# Altium schematic sheet ECG_Main.SchDoc: Heart ECG Monitor
size Letter; DrawnBy: Avishka Herath; SheetNumber: 1; SheetTotal: 3
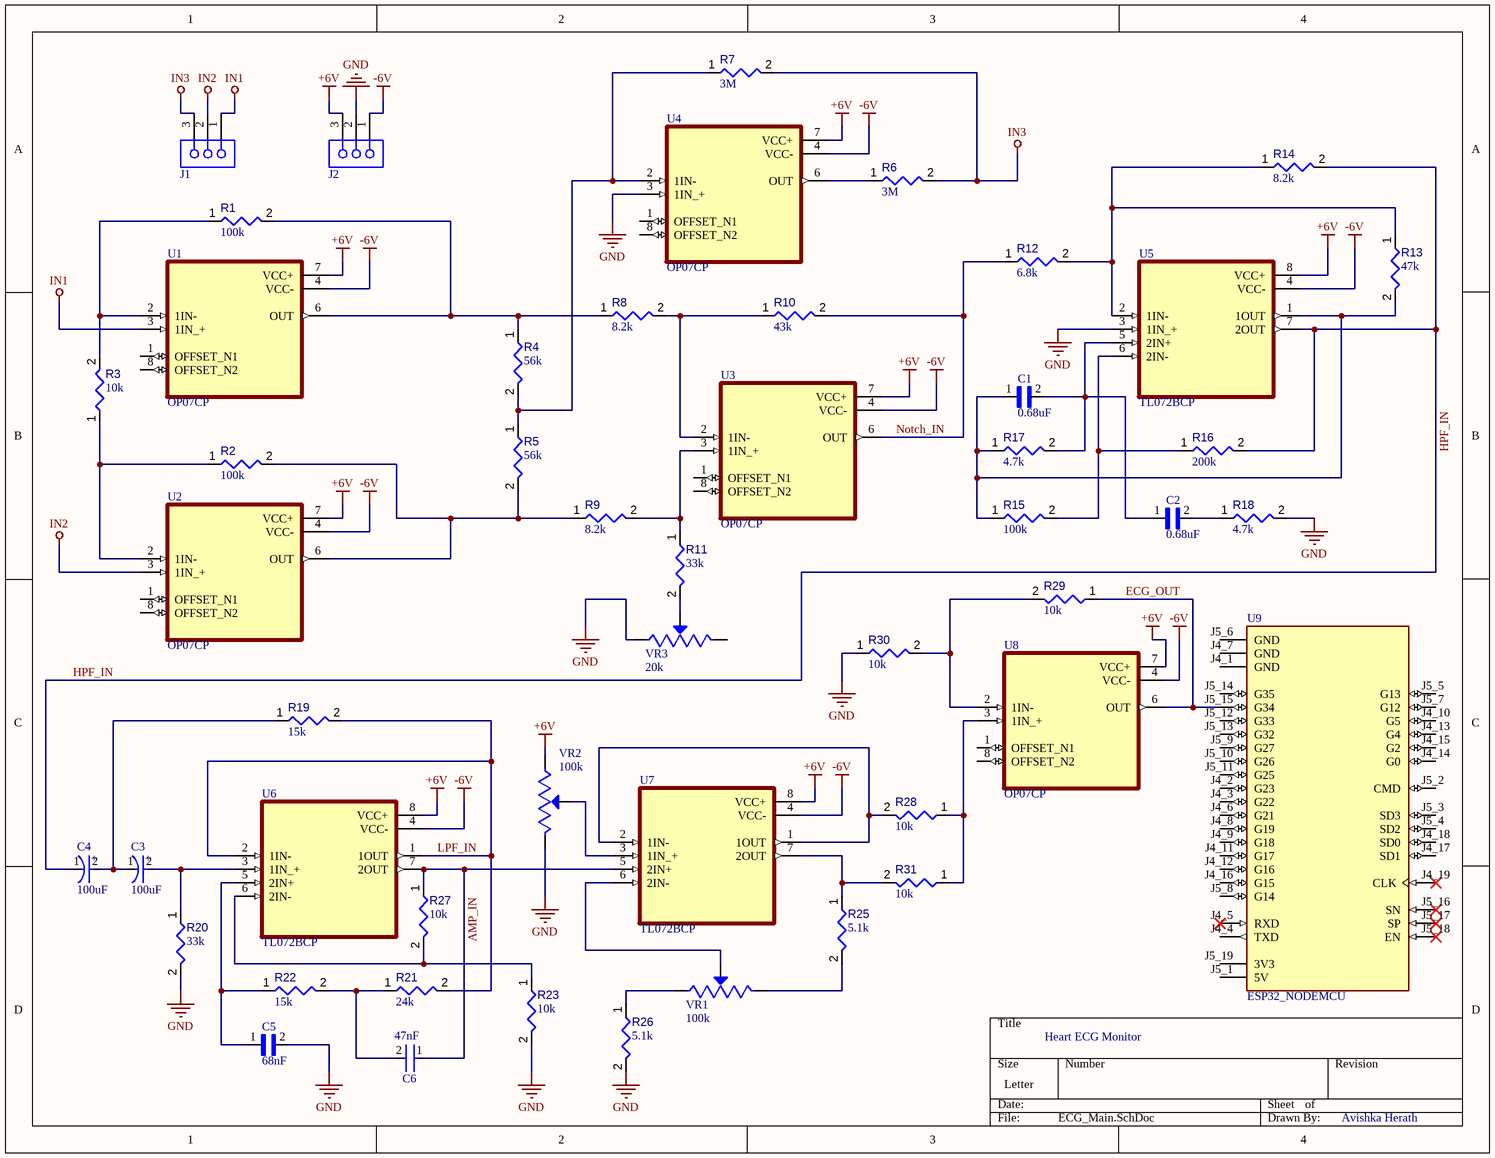
[diagram p0: ECG_Main.SchDoc]

## Parts
C1  0.68uF  [CAPRB500W50L550T350H600]
C2  0.68uF  [CAPRB500W50L550T350H600]
C3  100uF  [FP-RAD-TH-D_6_3_0_5-L_11-MFG]
C4  100uF  [FP-RAD-TH-D_6_3_0_5-L_11-MFG]
C5  68nF  [CAPRR750W60L1030T450H750]
C6  47nF  [FP-RCE0DB-MFG]
J1  SIGNAL_IN  [SMTC-SLW-103-01-X-S]  (value not drawn)
J2  POWER_IN  [SMTC-SLW-103-01-X-S]  (value not drawn)
R1  100k  [RESA60-630X240]
R2  100k  [RESA60-630X240]
R3  10k  [RESA60-630X240]
R4  56k  [RESA60-630X240]
R5  56k  [RESA60-630X240]
R6  3M  [RESA60-630X240]
R7  3M  [RESA60-630X240]
R8  8.2k  [RESA60-630X240]
R9  8.2k  [RESA60-630X240]
R10  43k  [RESA60-630X240]
R11  33k  [RESA60-630X240]
R12  6.8k  [RESA60-630X240]
R13  47k  [RESA60-630X240]
R14  8.2k  [RESA60-630X240]
R15  100k  [RESA60-630X240]
R16  200k  [RESA60-630X240]
R17  4.7k  [RESA60-630X240]
R18  4.7k  [RESA60-630X240]
R19  15k  [RESA60-630X240]
R20  33k  [RESA60-630X240]
R21  24k  [RESA60-630X240]
R22  15k  [RESA60-630X240]
R23  10k  [RESA60-630X240]
R25  5.1k  [RESA60-630X240]
R26  5.1k  [RESA60-630X240]
R27  10k  [RESA60-630X240]
R28  10k  [RESA60-630X240]
R29  10k  [RESA60-630X240]
R30  10k  [RESA60-630X240]
R31  10k  [RESA60-630X240]
U1  OP07CP  [DIP794W45P254L959H508Q8]
U2  OP07CP  [DIP794W45P254L959H508Q8]
U3  OP07CP  [DIP794W45P254L959H508Q8]
U4  OP07CP  [DIP794W45P254L959H508Q8]
U5  TL072BCP  [DIP794W45P254L959H508Q8]
U6  TL072BCP  [DIP794W45P254L959H508Q8]
U7  TL072BCP  [DIP794W45P254L959H508Q8]
U8  OP07CP  [DIP794W45P254L959H508Q8]
U9  ESP32_NODEMCU  [MODULE_ESP32_NODEMCU]
VR1  100k  [TRIM_3296W-OT1-103]
VR2  100k  [TRIM_3296W-OT1-103]
VR3  20k  [TRIM_3296W-OT1-103]

## Nets
+6V: J2.3 U1.7(VCC+) U2.7(VCC+) U3.7(VCC+) U4.7(VCC+) U5.8(VCC+) U6.8(VCC+) U7.8(VCC+) U8.7(VCC+) VR2.3(CW)
-6V: J2.1 U1.4(VCC-) U2.4(VCC-) U3.4(VCC-) U4.4(VCC-) U5.4(VCC-) U6.4(VCC-) U7.4(VCC-) U8.4(VCC-)
GND: C5.2 J2.2 R18.2 R20.2 R23.2 R26.2 R30.1 U4.3(1IN_+) U5.3(1IN_+) VR2.1(CCW) VR3.1(CCW)
IN1: J1.1 U1.3(1IN_+)
IN2: J1.2 U2.3(1IN_+)
IN3: J1.3 R6.2 R7.2
AMP_IN: C6.1 R27.1 U6.7(2OUT) U7.5(2IN+)
ECG_OUT: R29.1 U8.6(OUT) U9.J5_15(G34)
HPF_IN: C4.1(C) R14.2 R16.2 U5.7(2OUT)
LPF_IN: R19.2 R21.2 U6.1(1OUT) U6.2(1IN-)
Notch_IN: R10.2 R12.1 U3.6(OUT)
NetC1_1: C1.1 R13.2 R15.1 R17.1 U5.1(1OUT)
NetC1_2: C1.2 C2.1 R17.2 U5.5(2IN+)
NetC2_2: C2.2 R18.1
NetC3_1: C3.1(C) C4.2(A) R19.1
NetC3_2: C3.2(A) R20.1 U6.3(1IN_+)
NetC5_1: C5.1 R22.1 U6.5(2IN+)
NetC6_2: C6.2 R21.1 R22.2
NetR1_1: R1.1 R3.2 U1.2(1IN-)
NetR1_2: R1.2 R4.1 R8.1 U1.6(OUT)
NetR2_1: R2.1 R3.1 U2.2(1IN-)
NetR2_2: R2.2 R5.2 R9.1 U2.6(OUT)
NetR4_2: R4.2 R5.1 R7.1 U4.2(1IN-)
NetR6_1: R6.1 U4.6(OUT)
NetR8_2: R8.2 R10.1 U3.2(1IN-)
NetR9_2: R9.2 R11.1 U3.3(1IN_+)
NetR11_2: R11.2 VR3.2(WIPER)
NetR12_2: R12.2 R13.1 R14.1 U5.2(1IN-)
NetR15_2: R15.2 R16.1 U5.6(2IN-)
NetR23_1: R23.1 R27.2 U6.6(2IN-)
NetR25_1: R25.1 R31.2 U7.7(2OUT)
NetR25_2: R25.2 VR1.3(CW)
NetR26_1: R26.1 VR1.1(CCW)
NetR28_1: R28.1 R31.1 U8.3(1IN_+)
NetR28_2: R28.2 U7.1(1OUT) U7.2(1IN-)
NetR29_2: R29.2 R30.2 U8.2(1IN-)
NetU7_3: U7.3(1IN_+) VR2.2(WIPER)
NetU7_6: U7.6(2IN-) VR1.2(WIPER)

Not connected (* = marked no-connect by the designer): U1 1(OFFSET_N1) 8(OFFSET_N2); U2 1(OFFSET_N1) 8(OFFSET_N2); U3 1(OFFSET_N1) 8(OFFSET_N2); U4 1(OFFSET_N1) 8(OFFSET_N2); U8 1(OFFSET_N1) 8(OFFSET_N2); U9 J4_1(GND) J4_2(G23) J4_3(G22) J4_4(TXD) J4_5(RXD)* J4_6(G21) J4_7(GND) J4_8(G19) J4_9(G18) J4_10(G5) J4_11(G17) J4_12(G16) J4_13(G4) J4_14(G0) J4_15(G2) J4_16(G15) J4_17(SD1) J4_18(SD0) J4_19(CLK)* J5_1(5V) J5_2(CMD) J5_3(SD3) J5_4(SD2) J5_5(G13) J5_6(GND) J5_7(G12) J5_8(G14) J5_9(G27) J5_10(G26) J5_11(G25) J5_12(G33) J5_13(G32) J5_14(G35) J5_16(SN)* J5_17(SP)* J5_18(EN)* J5_19(3V3); VR3 3(CW)

## Notes on the sheet
- (in symbol CMP-001-00083-1) +

## Library data of the parts
C1 C2 = FA26NP02J472JNU06: MF: {'manufacturer': u'TDK'}; Value: *; MP: FA26NP02J472JNU06; Package: None; Price: None; Availability: Unavailable
C3 C4 = CMP-001-00083-1: Cap Aluminum Lytic 100uF 25V 20% (6.3 X 11.2mm) Radial 2.5mm 130mA 1000h 105°C Ammo Pack
C5 = ECQE2683JF: MF: {'manufacturer': u'Panasonic'}; Value: *; MP: ECQE2683JF; Package: None; Price: None; Availability: Unavailable
C6 = CMP-001-00084-1: Cap Ceramic 470pF 50V C0G 5% Radial 2.5mm 125°C Ammo Pack
J1 J2 = CMP-1023-00128-1: Low Profile Socket Strips, Through-hole, Vertical, -55 to 125 degC, 2.54 mm Pitch, 3-Pin, Female, RoHS; Manufacturer: Samtec; PartNumber: SLW-103-01-G-S; Pitch: 2.54 mm; ComponentLink2URL: http://www.samtec.com/documents/webfiles/pdf/SLW.PDF; PackageVersion: X, 9/1987; ComponentLink2Description: Datasheet; Mounting Technology: Through-hole; RoHS: True; ComponentLink3URL: http://www.samtec.com/documents/webfiles/cpdf/SLW-1XX-01-X-X-MKT.pdf; PackageDescription: Low Profile Socket Strip; Temperature Range: -55 to 125 degC; DatasheetVersion: F-214; ComponentLink1Description: Manufacturer URL; ComponentLink1URL: http://www.samtec.com; Orientation: Vertical; PackageReference: SLW-103-01-X-S; ComponentLink3Description: Package Specification
R1 R2 = CMP-009-00045-4: Axial Resistor, 100 KOhm, +/- 1%, 0.25 W, -55 to 155 degC, 2-Pin THD, RoHS, Bulk; Manufacturer: Yageo; Power: 250mW; Voltage Rating: 250V; Case/Package: Axial; Max Operating Temperature: 155°C; Package Reference: MFR-25; Package Quantity: 200; Value: 100k; Package Description: 2-Pin Axial Lead, Dia 2.4 mm, Body Length 6.3 mm; Tolerance: 1%; Manufacturer URL: http://www.yageo.com/; Packaging: Bulk; Mounting Technology: TH; Min Operating Temperature: -55°C; RoHS Compliant: True; Datasheet Version: Apr-13; Datasheet URL: http://www.yageo.com/documents/recent/Yageo%20LR_MFR_2013.pdf
R3 R21-R23 R25-R31 = CMP-009-00047-4: Axial Resistor, 10 KOhm, +/- 1%, 0.25 W, -55 to 155 degC, 2-Pin THD, RoHS, Bulk; Manufacturer: Yageo; Power: 250mW; Voltage Rating: 250V; Manufacturer URL: http://www.yageo.com/; Datasheet URL: http://www.yageo.com/documents/recent/Yageo%20LR_MFR_2013.pdf; Package Reference: MFR-25; Min Operating Temperature: -55°C; Mounting Technology: TH; Package Quantity: 200; Case/Package: Axial; Tolerance: 1%; RoHS Compliant: True; Datasheet Version: Apr-13; Packaging: Bulk; Max Operating Temperature: 155°C; Package Description: 2-Pin Axial Lead, Dia 2.4 mm, Body Length 6.3 mm
  R3 R23 R27-R31: Value: 10k
  R21: Value: 24k
  R22: Value: 15k
  R25 R26: Value: 5.1k
R4 R5 R10 R11 = CMP-009-00057-4: Axial Resistor, 47.5 KOhm, +/- 1%, 0.25 W, -55 to 155 degC, 2-Pin THD, RoHS, Bulk; Manufacturer: Yageo; Voltage Rating: 250V; Power: 250mW; RoHS Compliant: True; Packaging: Bulk; Manufacturer URL: http://www.yageo.com/; Package Quantity: 200; Datasheet URL: http://www.yageo.com/documents/recent/Yageo%20LR_MFR_2013.pdf; Case/Package: Axial; Package Reference: MFR-25; Tolerance: 1%; Max Operating Temperature: 155°C; Package Description: 2-Pin Axial Lead, Dia 2.4 mm, Body Length 6.3 mm; Datasheet Version: Apr-13; Min Operating Temperature: -55°C; Mounting Technology: TH
  R4 R5: Value: 56k
  R10: Value: 43k
  R11: Value: 33k
R6 R7 = CMP-009-00049-4: Axial Resistor, 1 MOhm, +/- 1%, 250 mW, -55 to 155 degC, 2-Pin THD, RoHS, Bulk; Manufacturer: Yageo; Voltage Rating: 250V; Power: 250mW; Datasheet Version: Apr-13; Package Reference: MFR-25; Package Quantity: 200; Min Operating Temperature: -55°C; RoHS Compliant: True; Mounting Technology: TH; Datasheet URL: http://www.yageo.com/documents/recent/Yageo%20LR_MFR_2013.pdf; Max Operating Temperature: 155°C; Package Description: 2-Pin Axial Lead, Dia 2.4 mm, Body Length 6.3 mm; Packaging: Bulk; Value: 3M; Tolerance: 1%; Case/Package: Axial; Manufacturer URL: http://www.yageo.com/
R8 R9 = CMP-009-00059-4: Axial Resistor, 4.75 KOhm, +/- 1%, 0.25 W, -55 to 155 degC, 2-Pin THD, RoHS, Bulk; Manufacturer: Yageo; Voltage Rating: 250V; Power: 250mW; Datasheet Version: Apr-13; Mounting Technology: TH; Package Reference: MFR-25; Value: 8.2k; RoHS Compliant: True; Composition: MetalFilm; Datasheet URL: http://www.yageo.com/documents/recent/Yageo%20LR_MFR_2013.pdf; Max Operating Temperature: 155°C; Package Quantity: 200; Case/Package: Axial; Package Description: 2-Pin Axial Lead, Dia 2.4 mm, Body Length 6.3 mm; Tolerance: 1%; Packaging: Bulk; Manufacturer URL: http://www.yageo.com/; Min Operating Temperature: -55°C
R12-R20 = CMP-009-00058-4: Axial Resistor, 47.5 Ohm, +/- 1%, 0.25 W, -55 to 155 degC, 2-Pin THD, RoHS, Bulk; Manufacturer: Yageo; Voltage Rating: 250V; Power: 250mW; Packaging: Bulk; Package Description: 2-Pin Axial Lead, Dia 2.4 mm, Body Length 6.3 mm; Package Reference: MFR-25; Case/Package: Axial; Tolerance: 1%; RoHS Compliant: True; Package Quantity: 200; Max Operating Temperature: 155°C; Manufacturer URL: http://www.yageo.com/; Datasheet URL: http://www.yageo.com/documents/recent/Yageo%20LR_MFR_2013.pdf; Min Operating Temperature: -55°C; Datasheet Version: Apr-13; Mounting Technology: TH
  R12: Value: 6.8k
  R13: Value: 47k
  R14: Value: 8.2k
  R15: Value: 100k
  R16: Value: 200k
  R17 R18: Value: 4.7k
  R19: Value: 15k
  R20: Value: 33k
U1-U4 U8 = OP07CP: MF: {'manufacturer': u'Texas Instruments'}; Value: *; MP: OP07CP; Package: None; Price: None; Availability: Unavailable
U5-U7 = CMP-005-000000-1: Dual low-noise JFET-input low offset operational amplifier 8-PDIP 0 to 70; MF: Texas Instruments; Price: None; Package: PDIP-8 Texas; Pin Count: 8; Purchase-URL: https://pricing.snapeda.com/search/part/TL072BCP/?ref=eda; Check_prices: https://www.snapeda.com/parts/TL072BCP/Texas%20Instruments/view-part/511536/?ref=eda; MP: TL072BCP; Design Item ID: TL072BCP; Component Type: Standard; Availability: Warning; SnapEDA_Link: https://www.snapeda.com/parts/TL072BCP/Texas%20Instruments/view-part/511536/?ref=snap; Value: *; Source: TL072BCP.SchLib
U9 = ESP32_NODEMCU: MF: {'manufacturer': u'Espressif Systems'}; Value: *; MP: ESP32_NODEMCU; Package: None; Price: None; Availability: Unavailable
VR1-VR3 = 3296W-OT1-103: Res Cermet Trimmer 500K Ohm 10% 0.5W 25(Elec)Turn 2.19mm (9.53 X 4.83 X 11.55mm) Pin Thru-Hole Tube; MF: {'manufacturer': u'Bourns'}; MP: 3296W-OT1-103; Availability: Unavailable; Value: *; Package: None; Price: None